# Altium schematic sheet half_bridge.SchDoc
size A4; SheetNumber: 3; SheetTotal: 14
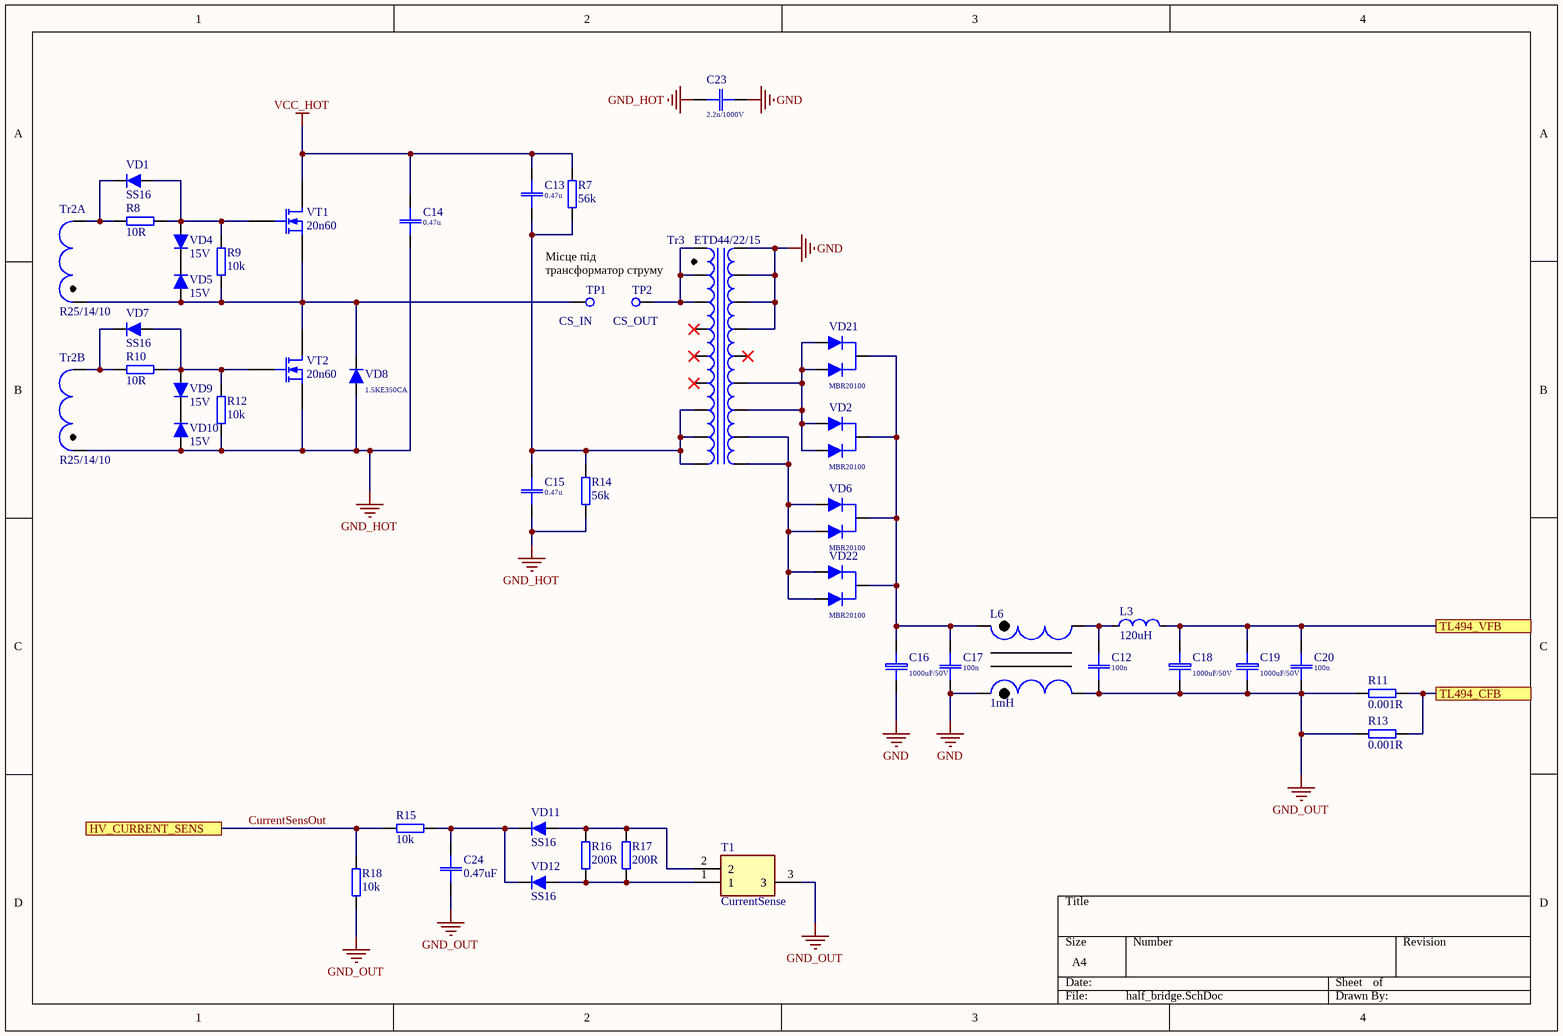
[diagram p0: half_bridge.SchDoc]

## Parts
C12  100n  [MKP X2 100nF 275V AC]
C13  0.47u  [MKP 31.5x11 h21 R27.5]
C14  0.47u  [MKP 31.5x11 h21 R27.5]
C15  0.47u  [MKP 31.5x11 h21 R27.5]
C16  1000uF/50V  [CAP: D16C7.5H25]
C17  100n  [MKP X2 100nF 275V AC]
C18  1000uF/50V  [CAP: D16C7.5H25]
C19  1000uF/50V  [CAP: D16C7.5H25]
C20  100n  [MKP X2 100nF 275V AC]
C23  2.2n/1000V  [MKP 26.5x7 h14 R22.5]
C24  0.47uF  [CAP: 0603]
L3  120uH  [IND: R39.9/24.1/14.5 (H)]
L6  1mH  [IND: R39.9/24.1/14.5 (H)]
R7  56k  [RES: 2W H]
R8  10R  [RES: 0805]
R9  10k  [RES: 0805]
R10  10R  [RES: 0805]
R11  0.001R  [RES: 2512]
R12  10k  [RES: 0805]
R13  0.001R  [RES: 2512]
R14  56k  [RES: 2W H]
R15  10k  [RES: 0603]
R16  200R  [RES: 0805]
R17  200R  [RES: 0805]
R18  10k  [RES: 0603]
T1  CurrentSense  [AC1015]
TP1  CS_IN  [TP: TEST POINT DIP]
TP2  CS_OUT  [TP: TEST POINT DIP]
Tr2  R25/14/10  [IND: R26.9/14.7/11.2 (H)]  (parts A,B of 2)
Tr3  ETD44/22/15  [TRANS: ETD44/22/15]
VD1  SS16  [DIODE: SMA]
VD2  MBR20100  [DO220D-RB-600]
VD4  15V  [DIODE: SMA]
VD5  15V  [DIODE: SMA]
VD6  MBR20100  [DO220D-RB-600]
VD7  SS16  [DIODE: SMA]
VD8  1.5KE350CA  [DO-201-500]
VD9  15V  [DIODE: SMA]
VD10  15V  [DIODE: SMA]
VD11  SS16  [DIODE: SOD123]
VD12  SS16  [DIODE: SOD123]
VD21  MBR20100  [DO220D-RB-600]
VD22  MBR20100  [DO220D-RB-600]
VT1  20n60  [TO247(H)]
VT2  20n60  [TO247(H)]

## Ports
HV_CURRENT_SENS, TL494_CFB, TL494_VFB

## Nets
GND: C16.2(-) C17.2 C23.2 L6.1 Tr3.15 Tr3.16 Tr3.17 Tr3.18
GND_HOT: C14.2 C15.2 C23.1 R12.2 R14.2 Tr2.3 VD8.1(A) VD10.1(A) VT2.3(S)
GND_OUT: C12.2 C18.2(-) C19.2(-) C20.2 C24.1 L6.2 R11.2 R13.2 R18.2 T1.3
VCC_HOT: C13.1 C14.1 R7.1 VT1.2(D)
CurrentSensOut: R15.2 R18.1 ; port HV_CURRENT_SENS
TL494_CFB: R11.1 R13.1 ; port TL494_CFB
TL494_VFB: C18.1(+) C19.1(+) C20.1 L3.2 ; port TL494_VFB
NetC12_1: C12.1 L3.1 L6.4
NetC13_2: C13.2 C15.1 R7.2 R14.1 Tr3.7 Tr3.8 Tr3.9
NetC16_1: C16.1(+) C17.1 L6.3 VD2.2(C) VD6.2(C) VD21.2(C) VD22.2(C)
NetC24_2: C24.2 R15.1 VD11.2(C) VD12.2(C)
NetR8_1: R8.1 R9.1 VD1.1(A) VD4.1(A) VT1.1(G)
NetR8_2: R8.2 Tr2.2 VD1.2(C)
NetR9_2: R9.2 TP1.1 Tr2.1 VD5.1(A) VD8.2(C) VT1.3(S) VT2.2(D)
NetR10_1: R10.1 R12.1 VD7.1(A) VD9.1(A) VT2.1(G)
NetR10_2: R10.2 Tr2.4 VD7.2(C)
NetR16_1: R16.1 R17.1 T1.2 VD11.1(A)
NetR16_2: R16.2 R17.2 T1.1 VD12.1(A)
NetTP2_1: TP2.1 Tr3.1 Tr3.2 Tr3.3
NetTr3_10: Tr3.10 Tr3.11 VD6.1(A) VD6.3(A) VD22.1(A) VD22.3(A)
NetTr3_12: Tr3.12 Tr3.13 VD2.1(A) VD2.3(A) VD21.1(A) VD21.3(A)
NetVD4_2: VD4.2(C) VD5.2(C)
NetVD9_2: VD9.2(C) VD10.2(C)

Not connected (* = marked no-connect by the designer): Tr3 4* 5* 6* 14*

## Notes on the sheet
- Місце під трансформатор струму

## Library data of the parts
C12 C17 C20 = X2 100n 275V AC: X2 250V AC; Price: 0.15; Value: 100n
C13-C15 = MKP10 0.47u 400V AC: Price: 1.43; Value: 0.47u
C16 C18 C19 = C_EL: Value: 1000uF/50V
C23 = MKP10 0.68u 400V AC: Value: 2.2n/1000V
C24 = C_SMD: Value: 0.47uF
L3 = L_DIP: Value: 120uH
L6 = DROSSEL: Value: 1mH
R7 R14 = R_DIP: Value: 56k
R8-R13 R15-R18 = R_SMD
  R8 R10: Value: 10R
  R9 R12 R15 R18: Value: 10k
  R11 R13: Value: 0.001R
  R16 R17: Value: 200R
T1 = AC-1020: Transformer; Manufacturer_Name: Nuvotem Talema; Height: 23mm; Manufacturer_Part_Number: AC-1020
TP1 TP2 = TEST POINT
  TP1: Value: CS_IN
  TP2: Value: CS_OUT
Tr2 = HulfBribge_Secondary: Value: R25/14/10
VD1 VD4 VD5 VD7 VD9-VD12 = DIODE_SMD
  VD1 VD7 VD11 VD12: Value: SS16
  VD4 VD5 VD9 VD10: Value: 15V
VD2 VD6 VD21 VD22 = DIODE_DIP_1: Value: MBR20100
VD8 = DIODE_DIP: Value: 1.5KE350CA
VT1 VT2 = MOSFET N_1: Value: 20n60
Tr3 = ETD44/22/15: Value: ETD44/22/15